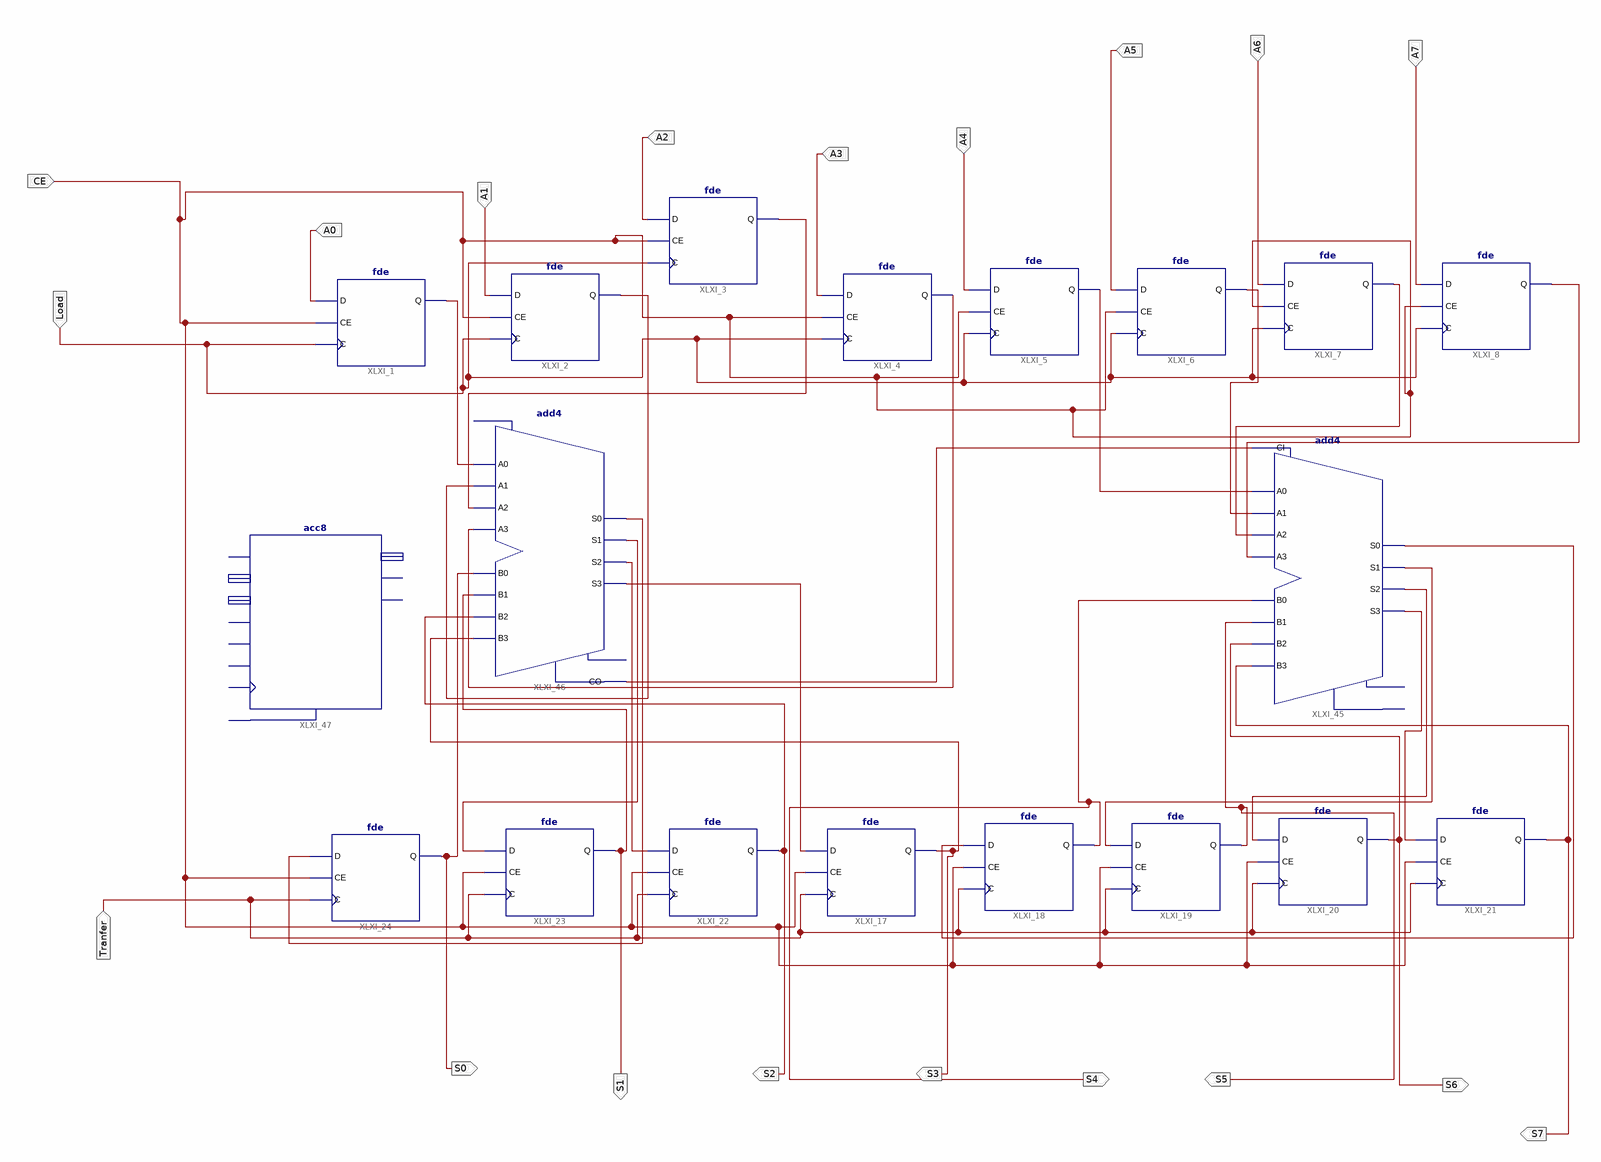
[diagram p0: schematic sheet 1]
// Xilinx ISE schematic Add_register.sch (spartan6) as structural Verilog: 19 symbols, 19 ports
module Add_register (
  input  A0,
  input  A1,
  input  A2,
  input  A3,
  input  A4,
  input  A5,
  input  A6,
  input  A7,
  input  Load,
  input  Tranfer,
  input  CE,
  output S1,
  output S2,
  output S6,
  output S7,
  output S0,
  output S3,
  output S4,
  output S5
);

  wire XLXN_1, XLXN_2, XLXN_3, XLXN_4, XLXN_5, XLXN_6, XLXN_7, XLXN_8, XLXN_10, XLXN_11, XLXN_12, XLXN_13,
       XLXN_14, XLXN_19, XLXN_20, XLXN_21, XLXN_22;

  fde XLXI_1 (.C(Load), .CE(CE), .D(A0), .Q(XLXN_1));
  fde XLXI_2 (.C(Load), .CE(CE), .D(A1), .Q(XLXN_2));
  fde XLXI_3 (.C(Load), .CE(CE), .D(A2), .Q(XLXN_3));
  fde XLXI_4 (.C(Load), .CE(CE), .D(A3), .Q(XLXN_4));
  fde XLXI_5 (.C(Load), .CE(CE), .D(A4), .Q(XLXN_5));
  fde XLXI_6 (.C(Load), .CE(CE), .D(A5), .Q(XLXN_6));
  fde XLXI_7 (.C(Load), .CE(CE), .D(A6), .Q(XLXN_7));
  fde XLXI_8 (.C(Load), .CE(CE), .D(A7), .Q(XLXN_8));
  fde XLXI_17 (.C(Tranfer), .CE(CE), .D(XLXN_14), .Q(S3));
  fde XLXI_18 (.C(Tranfer), .CE(CE), .D(XLXN_19), .Q(S4));
  fde XLXI_19 (.C(Tranfer), .CE(CE), .D(XLXN_20), .Q(S5));
  fde XLXI_20 (.C(Tranfer), .CE(CE), .D(XLXN_21), .Q(S6));
  fde XLXI_21 (.C(Tranfer), .CE(CE), .D(XLXN_22), .Q(S7));
  fde XLXI_22 (.C(Tranfer), .CE(CE), .D(XLXN_13), .Q(S2));
  fde XLXI_23 (.C(Tranfer), .CE(CE), .D(XLXN_12), .Q(S1));
  fde XLXI_24 (.C(Tranfer), .CE(CE), .D(XLXN_11), .Q(S0));
  add4 XLXI_45 (
    .A0(XLXN_5), .A1(XLXN_6), .A2(XLXN_7), .A3(XLXN_8), .B0(S4), .B1(S5), .B2(S6), .B3(S7), .CI(XLXN_10),
    .S0(XLXN_19), .S1(XLXN_20), .S2(XLXN_21), .S3(XLXN_22));  // open: CO, OFL
  add4 XLXI_46 (
    .A0(XLXN_1), .A1(XLXN_2), .A2(XLXN_3), .A3(XLXN_4), .B0(S0), .B1(S1), .B2(S2), .B3(S3), .CO(XLXN_10),
    .S0(XLXN_11), .S1(XLXN_12), .S2(XLXN_13), .S3(XLXN_14));  // open: CI, OFL
  acc8 XLXI_47 ();  // open: ADD, B, C, CE, CI, D, L, R, CO, OFL, Q
endmodule
